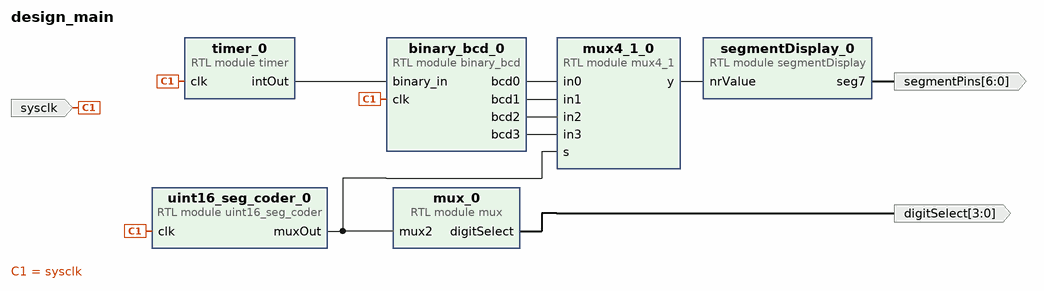
[diagram p0: block diagram of the top level]
# Vivado block design design_main, xc7a35tcpg236-1, Vivado 2019.1.2
create_bd_design design_main

create_bd_port -dir O -from 3 -to 0 digitSelect
create_bd_port -dir O -from 6 -to 0 segmentPins
create_bd_port -dir I -type clk sysclk
set_property -dict {CONFIG.FREQ_HZ 12000000} [get_bd_ports sysclk]

create_bd_cell -type module -reference segmentDisplay segmentDisplay_0
create_bd_cell -type module -reference mux mux_0
create_bd_cell -type module -reference mux4_1 mux4_1_0
create_bd_cell -type module -reference uint16_seg_coder uint16_seg_coder_0
create_bd_cell -type module -reference timer timer_0
create_bd_cell -type module -reference binary_bcd binary_bcd_0

# ---- connections ----

connect_bd_net [get_bd_pins mux_0/digitSelect] [get_bd_ports digitSelect]
connect_bd_net [get_bd_pins segmentDisplay_0/seg7] [get_bd_ports segmentPins]
connect_bd_net [get_bd_pins timer_0/intOut] [get_bd_pins binary_bcd_0/binary_in]
connect_bd_net [get_bd_pins binary_bcd_0/bcd0] [get_bd_pins mux4_1_0/in0]
connect_bd_net [get_bd_pins binary_bcd_0/bcd1] [get_bd_pins mux4_1_0/in1]
connect_bd_net [get_bd_pins binary_bcd_0/bcd2] [get_bd_pins mux4_1_0/in2]
connect_bd_net [get_bd_pins binary_bcd_0/bcd3] [get_bd_pins mux4_1_0/in3]
connect_bd_net [get_bd_pins uint16_seg_coder_0/muxOut] [get_bd_pins mux_0/mux2] [get_bd_pins mux4_1_0/s]
connect_bd_net [get_bd_ports sysclk] [get_bd_pins uint16_seg_coder_0/clk] [get_bd_pins timer_0/clk] [get_bd_pins binary_bcd_0/clk]
connect_bd_net [get_bd_pins mux4_1_0/y] [get_bd_pins segmentDisplay_0/nrValue]

validate_bd_design
save_bd_design
